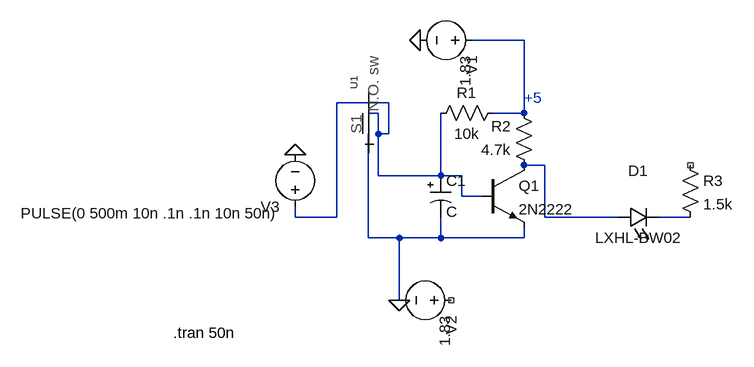
[diagram p0: schematic Draft6.asc]
Draft6.asc, the LTspice schematic file:
Version 4
SHEET 1 880 680
WIRE 208 -16 128 -16
WIRE 0 80 -80 80
WIRE -16 96 -32 96
WIRE 208 96 208 -16
WIRE 208 96 160 96
WIRE -16 128 -16 96
WIRE 0 128 0 80
WIRE 0 128 -16 128
WIRE 240 176 208 176
WIRE -16 192 -16 128
WIRE 80 192 80 96
WIRE 80 192 -16 192
WIRE 112 192 80 192
WIRE 112 224 112 192
WIRE 144 224 112 224
WIRE -144 256 -144 240
WIRE -80 256 -80 80
WIRE -80 256 -144 256
WIRE 240 256 240 176
WIRE 352 256 240 256
WIRE 464 256 416 256
WIRE -32 288 -32 128
WIRE 16 288 -32 288
WIRE 80 288 80 256
WIRE 80 288 16 288
WIRE 208 288 208 272
WIRE 208 288 80 288
WIRE 16 384 16 288
FLAG 48 -16 0
FLAG 16 384 0
FLAG -144 160 0
SYMBOL LED 352 272 R270
WINDOW 0 72 32 VTop 2
WINDOW 3 0 32 VBottom 2
SYMATTR InstName D1
SYMATTR Value LXHL-BW02
SYMBOL polcap 64 192 R0
SYMATTR InstName C1
SYMBOL res 176 80 R90
WINDOW 0 0 56 VBottom 2
WINDOW 3 32 56 VTop 2
SYMATTR InstName R1
SYMATTR Value 10k
SYMBOL res 224 192 R180
WINDOW 0 36 76 Left 2
WINDOW 3 36 40 Left 2
SYMATTR InstName R2
SYMATTR Value 4.7k
SYMBOL npn 144 176 R0
SYMATTR InstName Q1
SYMATTR Value 2N2222
SYMBOL res 448 160 R0
SYMATTR InstName R3
SYMATTR Value 1.5k
SYMBOL voltage 144 -16 R90
WINDOW 3 24 26 Left 2
WINDOW 123 0 0 Left 2
WINDOW 39 24 106 Left 2
SYMATTR Value 1.83
SYMATTR InstName V1
SYMBOL voltage 112 384 R90
WINDOW 3 24 26 Left 2
WINDOW 123 0 0 Left 2
WINDOW 39 24 106 Left 2
SYMATTR Value 1.83
SYMATTR InstName V2
SYMBOL voltage -144 256 R180
WINDOW 123 0 0 Left 2
WINDOW 39 24 106 Left 2
WINDOW 3 24 6 Left 2
SYMATTR Value PULSE(0 500m 10n .1n .1n 10n 50n)
SYMATTR InstName V3
SYMBOL Misc\\Momentary\ switch -32 112 R270
SYMATTR InstName U1
TEXT 208 72 Left 2 ;+5
TEXT -332 434 Left 2 !.tran 50n

The netlist it stands for:
* Draft6.asc
D1 N003 N004 LXHL-BW02
C1 N002 0 C
R1 N001 N002 10k
R2 N003 N001 4.7k
Q1 N003 N002 0 0 2N2222
R3 NC_01 N004 1.5k
V1 N001 0 1.83
V2 NC_02 0 1.83
V3 N002 0 PULSE(0 500m 10n .1n .1n 10n 50n)
S§U1 0 N002 S1 trigger switch
.model D D
.lib standard.dio
.model NPN NPN
.model PNP PNP
.lib standard.bjt
* +5
.tran 50n
.backanno
.end